# EAGLE design RF-input-bandpass (EAGLE 9.3.0)
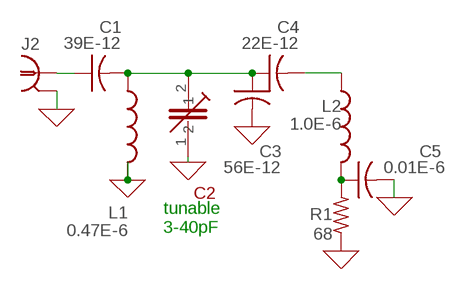
[diagram p0: schematic, sheet 1]

## Parts
C1  39E-12  C-US025-024X044  [C025-024X044]
C2  4.6E-12  GYC20000  [10_MM_TOP_BOTTOM_3_LEAD_STD]
C3  56E-12  C-US025-024X044  [C025-024X044]
C4  22E-12  C-US025-024X044  [C025-024X044]
C5  0.01E-6  C-US025-024X044  [C025-024X044]
J2  DC 0 AC 1E-6  R141426  [R141426]
L1  0.47E-6  L-US0204/5  [0204/5]
L2  1.0E-6  L-US0204/5  [0204/5]
R1  68  R-US_0204/2V  [0204V]

## Nets
0: C2.1 C3.2 C5.2 J2.2 J2.3 J2.4 J2.5 L1.2 R1.1 ; supply symbol labelled GND
N$1: C1.1 J2.1
N$2: C1.2 C2.2 C3.1 C4.1 L1.1
N$3: C4.2 L2.1
N$4: C5.1 L2.2 R1.2

## Notes on the sheet
- tunable
  3-40pF

## Library data of the parts
C1 C3-C5 = rcl:C-US: CAPACITOR, American symbol; SPICEPREFIX: C
C2 = sprague-goodman:GYC20000; SPICEPREFIX: C
J2 = con-coax:R141426: BNC COAX CONNECTOR Radiall 50/75 Ohm Spoerle; MF: FARNELL; MPN: R141426161; OC_FARNELL: 4195115; OC_NEWARK: 14J7919; SPICEPREFIX: V
L1 L2 = rcl:L-US: INDUCTOR, American symbol; SPICEPREFIX: L
R1 = adafruit:R-US_: RESISTOR, American symbol; SPICEPREFIX: R

## Net classes
0 default: width 1.016 mm, clearance 0.508 mm

## Board
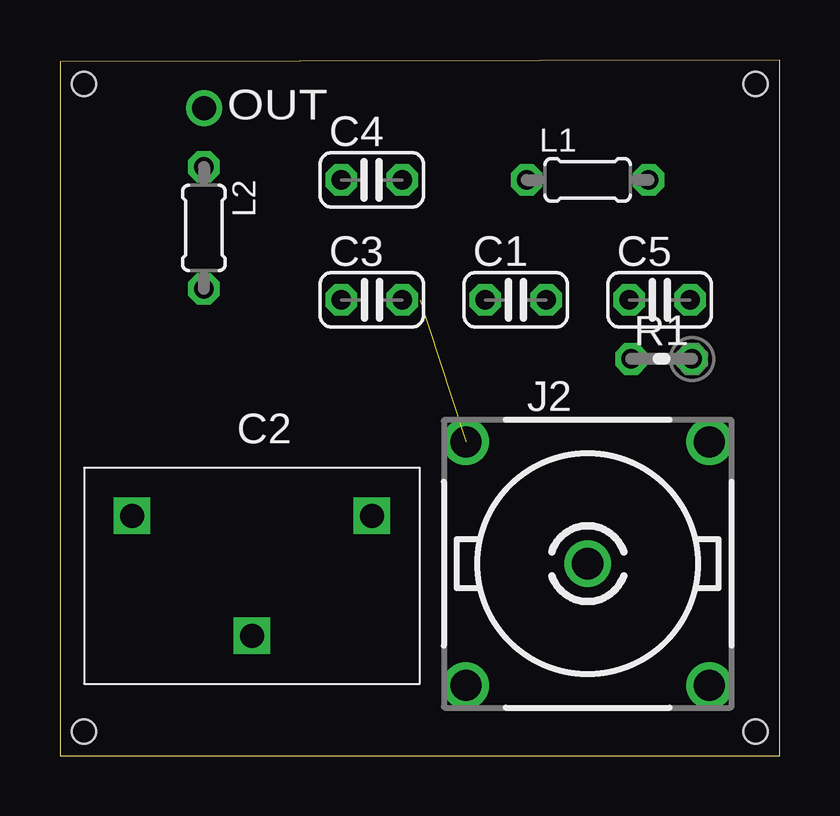
[diagram p1: board, top side]
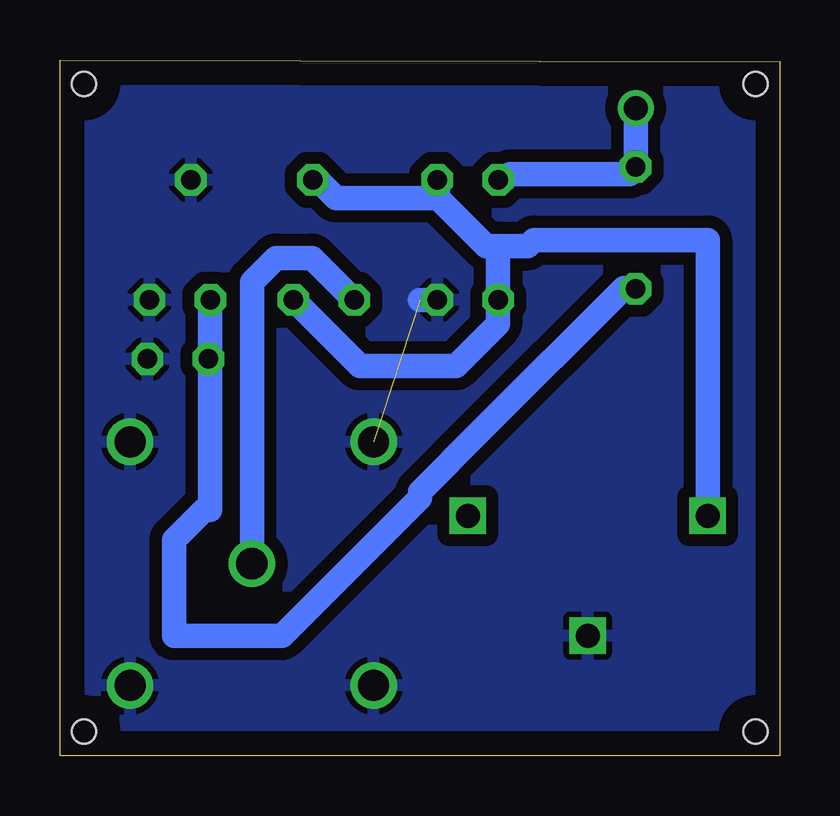
[diagram p2: board, bottom side, seen from below]

Size 30 x 29 mm. Coordinates in mm from the lower left corner, seen from the top.
Outline: 0,0 30,0 30,29 0,28.93 0,0
Copper layers (1*16): Top 0.035mm / dielectric 1.5mm / Bottom 0.035mm
Design rules "default": minimum track width 6mil, minimum drill 0.35mm, track to track 6mil, track to pad 6mil, pad to pad 6mil, via to via 6mil, smd to smd 6mil, copper to edge 40mil, drill to drill 6mil, minimum pad ring 10mil, minimum via ring 8mil, stop-mask expansion 4mil, vias tented up to drill 0mil, thermal gap 10mil
Holes 1 mm at 29,1 1,1 1,28 29,28

### Footprints (pad centres in the part's own frame; a part is rotated, then mirrored left to right if it is on the bottom)
C025-024X044 = drill 0.813 octagon: 1 -1.27,0; 2 1.27,0
10_MM_TOP_BOTTOM_3_LEAD_STD = drill 1 square: 1 7,7; 2 2,2; 3 2,12
R141426 = drill 1.295: 1 0,0; 2 5.08,5.08; 3 -5.08,5.08; 4 -5.08,-5.08; 5 5.08,-5.08
0204/5 = drill 0.813 octagon: 1 -2.54,0; 2 2.54,0
0204V = drill 0.813 octagon: 1 -1.27,0; 2 1.27,0

### Placement (x,y rotation side)
C1  19,19 0 top
C2  1,12 270 top
C3  13,19 0 top
C4  13,24 180 top
C5  25,19 0 top
J2  22,8 0 top
L1  22,24 0 top
L2  6,22 270 top
R1  25.08,16.53 180 top

### Tracks (layer width: path | path; a pad name or v marks a point on that pad's centre or on a via)
0  (1 unrouted)
  Bottom 1.016: C3.2 15,19
  pour Bottom (isolate 0.254): 0,29 30,29 30,0 0,0
N$1
  Bottom 1.016: J2.1 22,19.75 21,20.75 19.5,20.75 17.75,19 C1.1
N$2
  Bottom 1.016: 11.75,21.25 11.75,19 C3.1 11.75,18.5 11.75,18 13.5,16.25 17.5,16.25 20.25,19 C1.2 | 11.75,21.25 12.25,21.25 14.25,23.25 | 14.25,23.25 14.25,24 C4.1 | 14.25,23.25 18.5,23.25 19.25,24 L1.1 | C2.2 3,21.5 10.25,21.5 10.5,21.25 11.75,21.25
N$3  (via drill 1)
  Bottom 1.016: v6,27 L2.1 6.25,24.25 11.25,24.25 11.5,24 C4.2
N$4
  Bottom 1.016: 23.75,16.53 23.75,19 C5.1 | L2.2 6,19.5 6.5,19.5 12.45,13.55 15,11 15,10.75 20.75,5 25.25,5 25.25,9 24,10.25 23.75,10.25 23.75,16 23.75,16.53 | R1.2 23.75,16.53

### Text on the board
tNames: OUT